# EAGLE schematic connections (EAGLE 9.1.0)
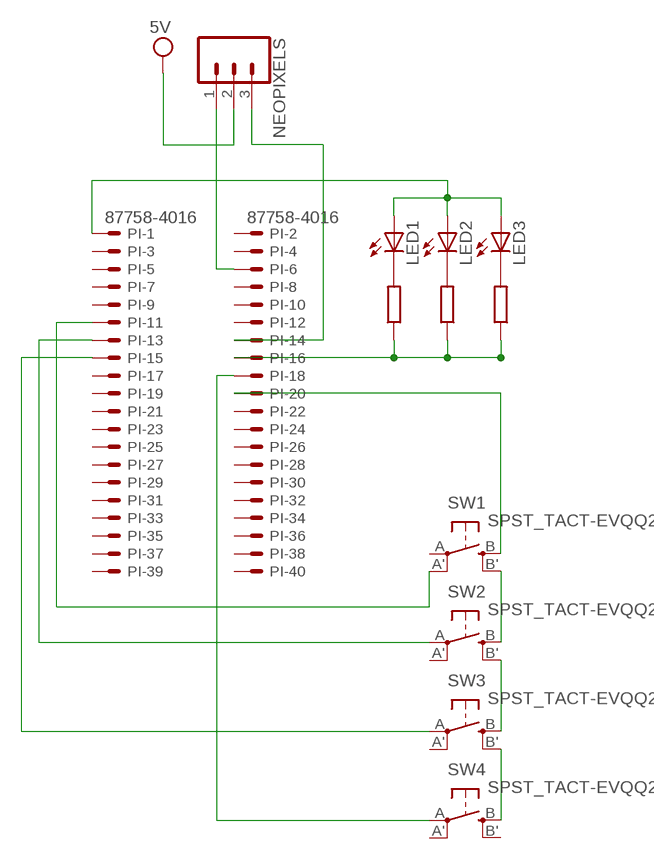
[diagram p0: schematic, sheet 1]

## Parts
LED1  LED3MM  [LED3MM]
LED2  LED3MM  [LED3MM]
LED3  LED3MM  [LED3MM]
NEOPIXELS  CONN_031X03_NO_SILK  [1X03_NO_SILK]
PI  87758-4016  [87758-4016]
SW1  SPST_TACT-EVQQ2  [EVQ-Q2]
SW2  SPST_TACT-EVQQ2  [EVQ-Q2]
SW3  SPST_TACT-EVQQ2  [EVQ-Q2]
SW4  SPST_TACT-EVQQ2  [EVQ-Q2]

## Nets
N$1: NEOPIXELS.1 PI.6
N$2: NEOPIXELS.3 PI.14
N$3: SW1.B'(S1) SW2.B(S)
N$4: SW2.B'(S1) SW3.B(S)
N$5: SW3.B'(S1) SW4.B(S)
N$6: PI.20 SW1.B(S)
N$7: LED1.A LED2.A LED3.A PI.1
N$8: PI.16
N$9: PI.11 SW1.A'(P1)
N$10: PI.13 SW2.A(P)
N$11: PI.15 SW3.A(P)
N$12: PI.18 SW4.A(P)
VCC: NEOPIXELS.2 ; supply symbol labelled 5V
Unconnected: LED1.K(C) LED2.K(C) LED3.K(C) PI.2 PI.3 PI.4 PI.5 PI.7 PI.8 PI.9 PI.10 PI.12 PI.17 PI.19 PI.21 PI.22 PI.23 PI.24 PI.25 PI.26 PI.27 PI.28 PI.29 PI.30 PI.31 PI.32 PI.33 PI.34 PI.35 PI.36 PI.37 PI.38 PI.39 PI.40 SW1.A(P) SW2.A'(P1) SW3.A'(P1) SW4.A'(P1) SW4.B'(S1)

## Library data of the parts
LED1-LED3 = adafruit:LED: LED OSRAM: - CHIPLED LG R971, LG N971, LY N971, LG Q971, LY Q971, LO R971, LY R971 LH N974, LH R974 LS Q976, LO Q976, LY Q976 LO Q996 - Hyper CHIPLED LW Q18S LB Q993, LB Q99A, LB R99A - SideLED LS A670, LO A670, LY A670, LG A670, LP A670 LB A673, LV A673, LT A673, LW A673 LH A674 LY A675 LS A676, LA A676, LO A676, LY A676, LW A676 LS A679, LY A679, LG A679 - Hyper Micro SIDELED® LS Y876, LA Y876, LO Y876, LY Y876 LT Y87S - SmartLED LW L88C, LW L88S LB L89C, LB L89S, LG L890 LS L89K, LO L89K, LY L89K LS L896, LA L896, LO L896, LY L896 - TOPLED LS T670, LO T670, LY T670, LG T670, LP T670 LSG T670, LSP T670, LSY T670, LOP T670, LYG T670 LG T671, LOG T671, LSG T671 LB T673, LV T673, LT T673, LW T673 LH T674 LS T676, LA T676, LO T676, LY T676, LB T676, LH T676, LSB T676, LW T676 LB T67C, LV T67C, LT T67C, LS T67K, LO T67K, LY T67K, LW E67C LS E67B, LA E67B, LO E67B, LY E67B, LB E67C, LV E67C, LT E67C LW T67C LS T679, LY T679, LG T679 LS T770, LO T770, LY T770, LG T770, LP T770 LB T773, LV T773, LT T773, LW T773 LH T774 LS E675, LA E675, LY E675, LS T675 LS T776, LA T776, LO T776, LY T776, LB T776 LHGB T686 LT T68C, LB T68C - Hyper Mini TOPLED® LB M676 - Mini TOPLED Santana® LG M470 LS M47K, LO M47K, LY M47K Source: http://www.osram.convergy.de/
NEOPIXELS = SparkFun-Connectors:CONN_03: Multi connection point. Often used as Generic Header-pin footprint for 0.1 inch spaced/style header connections On any of the 0.1 inch spaced packages, you can populate with these: Break Away Headers - Straight <https://www.sparkfun.com/products/116> (PRT-00116) Break Away Male Headers - Right Angle <https://www.sparkfun.com/products/553> (PRT-00553) Female Headers <https://www.sparkfun.com/products/115> (PRT-00115) Break Away Headers - Machine Pin <https://www.sparkfun.com/products/117> (PRT-00117) Break Away Female Headers - Swiss Machine Pin <https://www.sparkfun.com/products/743> (PRT-00743) Stackable Header - 3 Pin (Female, 0.1") <https://www.sparkfun.com/products/13875> (PRT-13875) For SCREWTERMINALS and SPRING TERMINALS visit here: Screw Terimnals on SparkFun.com <https://www.sparkfun.com/search/results?term=Screw+Terminals> (5mm/3.5mm/2.54mm spacing) This device is also useful as a general connection point to wire up your design to another part of your project. Our various solder wires solder well into these plated through hole pads. Hook-Up Wire - Assortment (Stranded, 22 AWG) <https://www.sparkfun.com/products/11375> (PRT-11375) Hook-Up Wire - Assortment (Solid Core, 22 AWG) <https://www.sparkfun.com/products/11367> (PRT-11367) View the entire wire category on our website here <https://www.sparkfun.com/categories/141> Special notes: Molex polarized connector foot print use with SKU : PRT-08232 with associated crimp pins and housings.
PI = con-molex:87758-4016: 40 Pin - 2mm Dual Row Single Wafer, Vertical T/H HDR Source: http://www.molex.com/pdm_docs/sd/877580616_sd.pdf; MF: MOLEX; MPN: 87758-4016; OC_FARNELL: unknown; OC_NEWARK: 25M5691
SW1-SW4 = adafruit:SPST_TACT: SMT 6mm switch, EVQQ2 series http://www.ladyada.net/library/eagle